# EAGLE design main_SMD_FET (EAGLE 9.6.2)
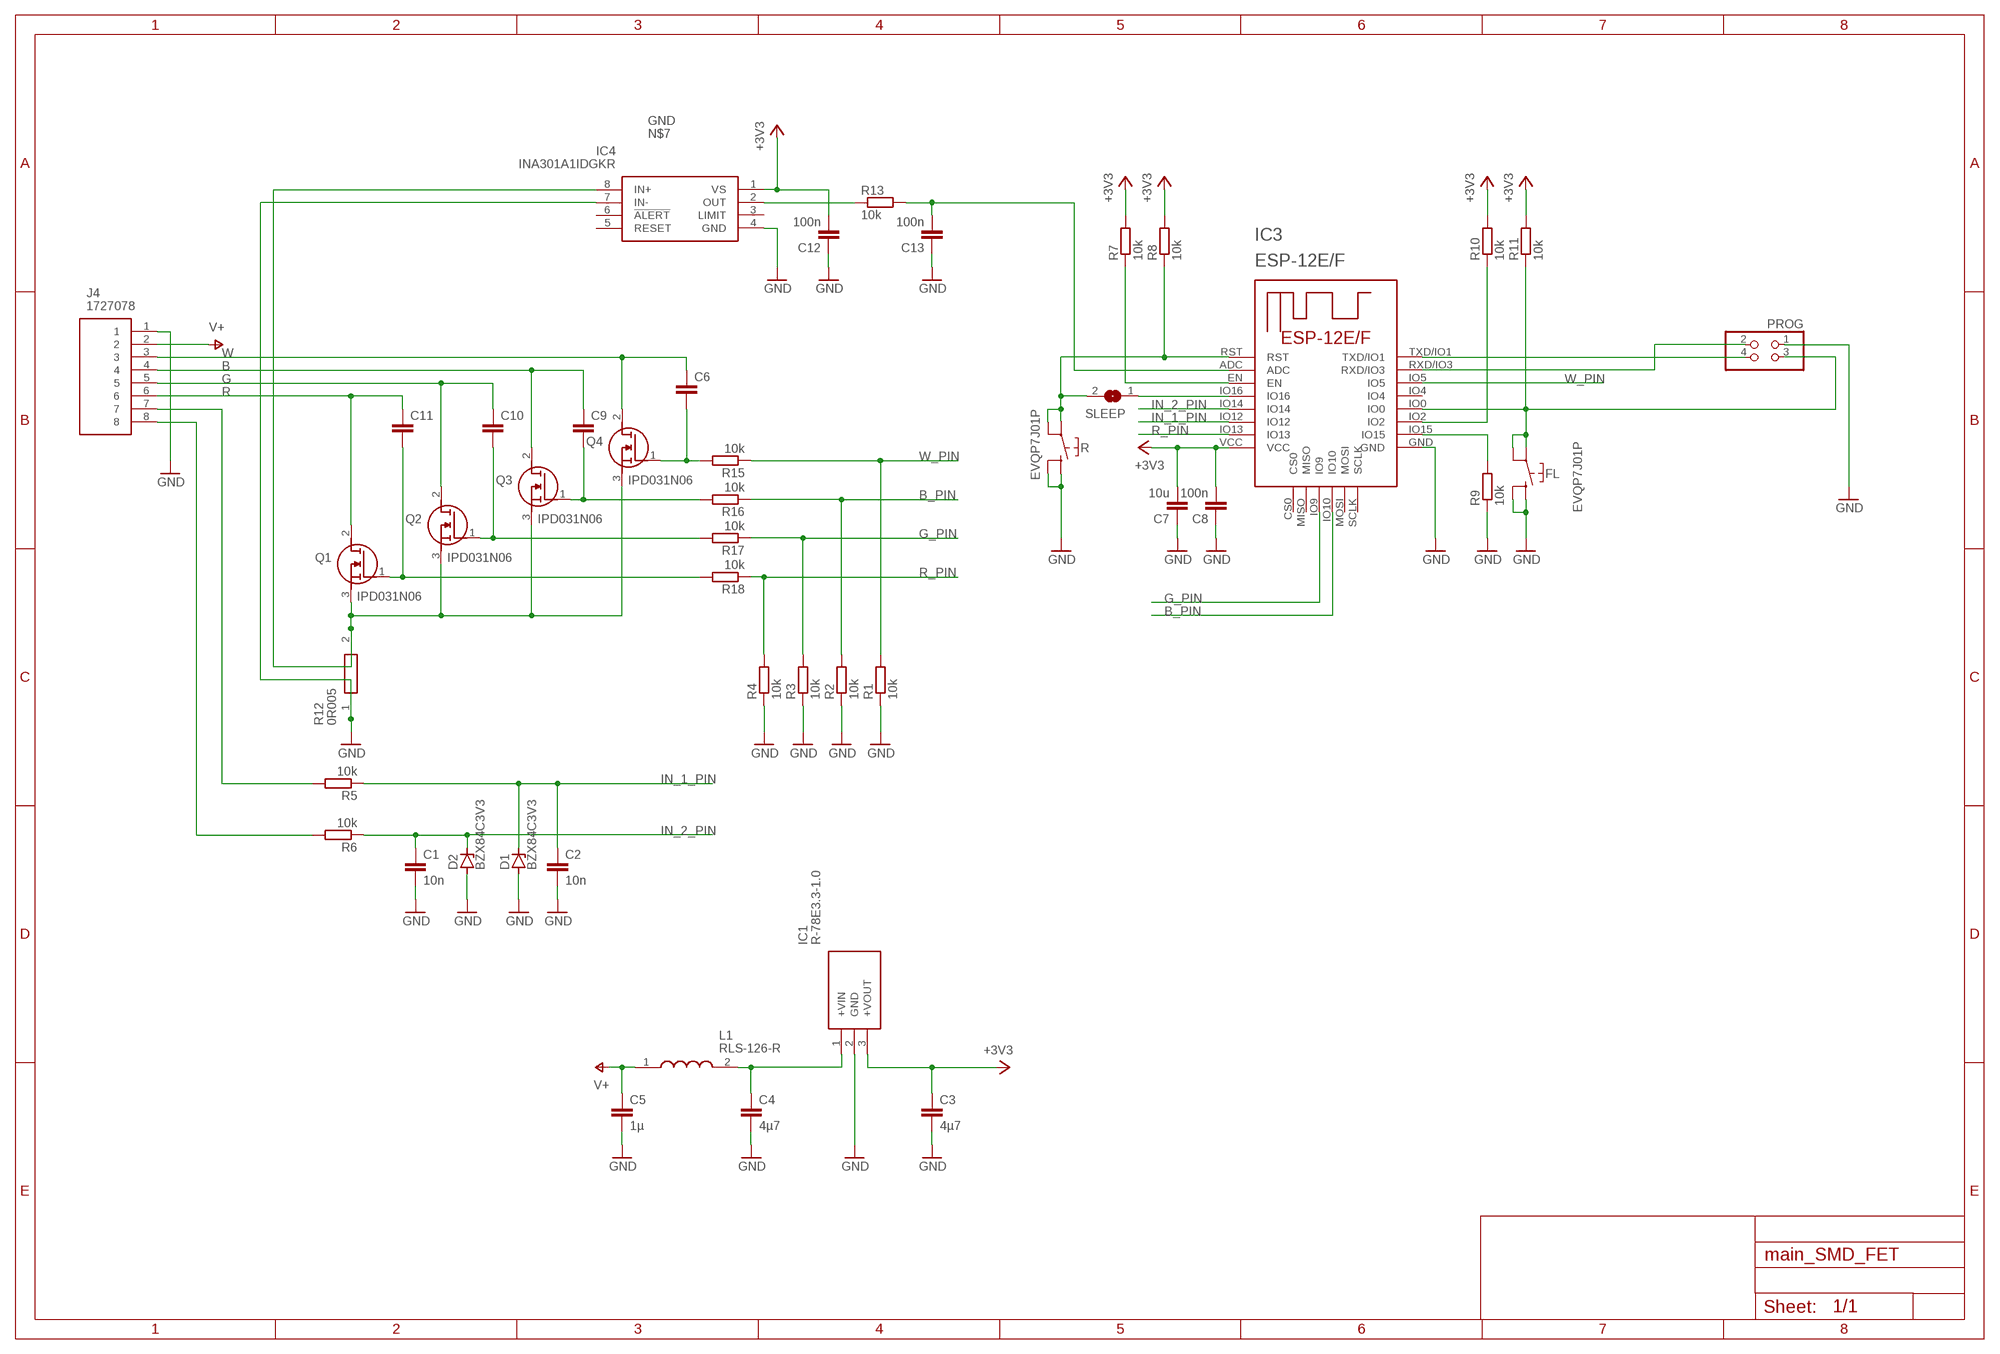
[diagram p0: schematic, sheet 1]

## Parts
C1  10n  C-EUC0603  [C0603]
C2  10n  C-EUC0603  [C0603]
C3  4µ7  C-EUC0603  [C0603]
C4  4µ7  C-EUC1206  [C1206]
C5  1µ  C-EUC1206  [C1206]
C6  C-EUC0402  [C0402]
C7  10u  C-EUC0603  [C0603]
C8  100n  C-EUC0603  [C0603]
C9  C-EUC0402  [C0402]
C10  C-EUC0402  [C0402]
C11  C-EUC0402  [C0402]
C12  100n  C-EUC0603  [C0603]
C13  100n  C-EUC0603  [C0603]
D1  BZX84C3V3  BZX84CSMD  [TO236]
D2  BZX84C3V3  BZX84CSMD  [TO236]
FL  EVQP7J01P  [EVQP7J01P]
IC1  R-78E3.3-1.0  [R78E3310]
IC3  ESP-12E/F  [ESP-12E]
IC4  INA301A1IDGKR  [SOP65P490X110-8N]
J4  1727078  [SHDR8W90P0X381_1X8_3047X730X86]
L1  RLS-126-R  [RLS126R]
PROG  PINHD-2X2  [2X02]
Q1  IPD031N06  IPD031N06L3GATMA1  [IPD031N06L3GATMA1]
Q2  IPD031N06  IPD031N06L3GATMA1  [IPD031N06L3GATMA1]
Q3  IPD031N06  IPD031N06L3GATMA1  [IPD031N06L3GATMA1]
Q4  IPD031N06  IPD031N06L3GATMA1  [IPD031N06L3GATMA1]
R  EVQP7J01P  [EVQP7J01P]
R1  10k  R-EU_R0402  [R0402]
R2  10k  R-EU_R0402  [R0402]
R3  10k  R-EU_R0402  [R0402]
R4  10k  R-EU_R0402  [R0402]
R5  10k  R-EU_R0603  [R0603]
R6  10k  R-EU_R0603  [R0603]
R7  10k  R-EU_R0402  [R0402]
R8  10k  R-EU_R0402  [R0402]
R9  10k  R-EU_R0402  [R0402]
R10  10k  R-EU_R0402  [R0402]
R11  10k  R-EU_R0402  [R0402]
R12  0R005  PCS1206DR0100ET  [RESC3216X68N]
R13  10k  R-EU_R0402  [R0402]
R15  10k  R-EU_R0402  [R0402]
R16  10k  R-EU_R0402  [R0402]
R17  10k  R-EU_R0402  [R0402]
R18  10k  R-EU_R0402  [R0402]
SLEEP  SJ  [SJ]

## Nets
+3V3: C3.1 C7.2 C8.2 C12.2 IC1.3(+VOUT) IC3.VCC IC4.1(VS) R7.2 R8.2 R10.2 R11.2
B: C9.1 J4.4 Q3.2(D)
B_PIN: IC3.IO10 R2.2 R16.1
G: C10.1 J4.5 Q2.2(D)
G_PIN: IC3.IO9 R3.2 R17.1
GND: C1.2 C2.2 C3.2 C4.2 C5.2 C7.1 C8.1 C12.1 C13.1 D1.A D2.A FL.A2(COM_1) FL.B2(COM_2) IC1.2(GND) IC3.GND IC4.4(GND) IC4.7(IN-) J4.1 PROG.1 R1.1 R2.1 R3.1 R4.1 R9.1 R12.1 R.A2(COM_1) R.B2(COM_2)
IN_1_PIN: C2.1 D1.C IC3.IO12 R5.1
IN_2_PIN: C1.1 D2.C IC3.IO14 R6.1
N$: C13.2 IC3.ADC R13.2
N$2: C11.2 Q1.1(G) R18.2
N$3: IC3.RST R8.1 R.A1(NO_1) R.B1(NO_2) SLEEP.2
N$4: J4.7 R5.2
N$5: J4.8 R6.2
N$6: IC3.RXD/IO3 PROG.2
N$7: IC4.8(IN+) Q1.3(S) Q2.3(S) Q3.3(S) Q4.3(S) R12.2
N$8: IC4.2(OUT) R13.1
N$9: C4.1 IC1.1(+VIN) L1.2
N$10: IC3.EN R7.1
N$11: IC3.IO2 R10.1
N$12: C10.2 Q2.1(G) R17.2
N$13: FL.A1(NO_1) FL.B1(NO_2) IC3.IO0 PROG.3 R11.1
N$14: C9.2 Q3.1(G) R16.2
N$15: C6.2 Q4.1(G) R15.2
N$17: IC3.TXD/IO1 PROG.4
N$21: IC3.IO16 SLEEP.1
N$25: IC3.IO15 R9.2
R: C11.1 J4.6 Q1.2(D)
R_PIN: IC3.IO13 R4.2 R18.1
V+: C5.1 J4.2 L1.1
W: C6.1 J4.3 Q4.2(D)
W_PIN: IC3.IO5 R1.2 R15.1
Unconnected: IC3.CS0 IC3.IO4 IC3.MISO IC3.MOSI IC3.SCLK IC4.3(LIMIT) IC4.5(RESET) IC4.6(!ALERT)

## Library data of the parts
C1-C13 = rcl:C-EU: CAPACITOR, European symbol; SPICEPREFIX: C
D1 D2 = diode:BZX84CSMD: Z DIODE
FL R = SamacSys_Parts:EVQP7J01P: PANASONIC - EVQP7J01P - TACTILE SW, SPST-NO, 0.05A, 12V, SMD Source: Datasheet <https://www.arrow.com/en/products/evq-p7j01p/panasonic>; ARROW_PART_NUMBER: EVQP7J01P; ARROW_PRICE-STOCK: https://www.arrow.com/en/products/evq-p7j01p/panasonic; DESCRIPTION: PANASONIC - EVQP7J01P - TACTILE SW, SPST-NO, 0.05A, 12V, SMD; HEIGHT: 1.35mm; MANUFACTURER_NAME: Panasonic; MANUFACTURER_PART_NUMBER: EVQP7J01P
IC1 = SamacSys_Parts:R-78E3.3-1.0: Recom DC-DC Switching Regulator, 7 28V dc Input, 3.3V Output, 1A Source: Datasheet <https://componentsearchengine.com/Datasheets/1/R-78E3.3-1.0.pdf>; ARROW_PART_NUMBER: R-78E3.3-1.0; ARROW_PRICE-STOCK: https://www.arrow.com/en/products/r-78e3.3-1.0/recom-power; DESCRIPTION: Recom DC-DC Switching Regulator, 7 28V dc Input, 3.3V Output, 1A; HEIGHT: 10.9mm; MANUFACTURER_NAME: RECOM Power; MANUFACTURER_PART_NUMBER: R-78E3.3-1.0; MOUSER_PART_NUMBER: 919-R-78E3.3-1.0; MOUSER_PRICE-STOCK: https://www.mouser.co.uk/ProductDetail/RECOM-Power/R-78E33-10/?qs=D0iH%252BVFiYPOgLjjtWWnV0Q%3D%3D
IC3 = esp-12e-f:ESP-12E/F
IC4 = SamacSys_Parts:INA301A1IDGKR: 36V, Low-/High-side, Voltage Output CSA with Comparator Source: Datasheet <http://www.ti.com/lit/gpn/INA301>; ARROW_PART_NUMBER: INA301A1IDGKR; ARROW_PRICE-STOCK: https://www.arrow.com/en/products/ina301a1idgkr/texas-instruments; DESCRIPTION: 36V, Low-/High-side, Voltage Output CSA with Comparator; HEIGHT: 1.1mm; MANUFACTURER_NAME: Texas Instruments; MANUFACTURER_PART_NUMBER: INA301A1IDGKR; MOUSER_PART_NUMBER: 595-INA301A1IDGKR; MOUSER_PRICE-STOCK: https://www.mouser.co.uk/ProductDetail/Texas-Instruments/INA301A1IDGKR/?qs=yajEpaT76uR6go0HjUkNgA%3D%3D
J4 = SamacSys_Parts_PHOENIX:1727078: 3.81mm pitch,vertical mount,PCB,screw terminal,8way Source: Datasheet <https://www.phoenixcontact.com/online/portal/gb?uri=pxc-oc-itemdetail:pid=1727078&library=gben&tab=1>; ALLIED_NUMBER: 70054363; ALLIED_PRICE-STOCK: https://www.alliedelec.com/phoenix-contact-1727078/70054363/; DESCRIPTION: 3.81mm pitch,vertical mount,PCB,screw terminal,8way; HEIGHT: 8.65mm; MANUFACTURER_NAME: Phoenix Contact; MANUFACTURER_PART_NUMBER: 1727078; MOUSER_PART_NUMBER: 651-1727078; MOUSER_PRICE-STOCK: https://www.mouser.com/Search/Refine.aspx?Keyword=651-1727078; RS_PART_NUMBER: 2204399; RS_PRICE-STOCK: https://uk.rs-online.com/web/p/products/2204399
L1 = SamacSys_Parts:RLS-126-R: Fixed Inductors Line Inductors for RECOM Power Supply Source: Datasheet <https://componentsearchengine.com/Datasheets/1/RLS-126-R.pdf>; ARROW_PART_NUMBER: RLS-126-R; ARROW_PRICE-STOCK: https://www.arrow.com/en/products/rls-126-r/recom-power; DESCRIPTION: Fixed Inductors Line Inductors for RECOM Power Supply; HEIGHT: 3.1mm; MANUFACTURER_NAME: RECOM Power; MANUFACTURER_PART_NUMBER: RLS-126-R; MOUSER_PART_NUMBER: 919-RLS-126-R; MOUSER_PRICE-STOCK: https://www.mouser.co.uk/ProductDetail/RECOM-Power/RLS-126-R/?qs=gZXFycFWdAPAKiXpeP%2FMQg%3D%3D
PROG = Tyco_By_element14_Batch_1:PINHD-2X2: PIN HEADER
Q1-Q4 = SamacSys_Parts:IPD031N06L3GATMA1: MOSFET N-Ch 60V 100A DPAK-2 OptiMOS 3 Source: Datasheet <https://datasheet.datasheetarchive.com/originals/dk/DKDS-30/599831.pdf>; ARROW_PART_NUMBER: IPD031N06L3GATMA1; ARROW_PRICE-STOCK: https://www.arrow.com/en/products/ipd031n06l3gatma1/infineon-technologies-ag; DESCRIPTION: MOSFET N-Ch 60V 100A DPAK-2 OptiMOS 3; HEIGHT: 2.563mm; MANUFACTURER_NAME: Infineon; MANUFACTURER_PART_NUMBER: IPD031N06L3GATMA1; MOUSER_PART_NUMBER: 726-IPD031N06L3GATMA; MOUSER_PRICE-STOCK: https://www.mouser.co.uk/ProductDetail/Infineon-Technologies/IPD031N06L3GATMA1/?qs=OwbwYO03UsJYrPy01%2FpZig%3D%3D
R1-R11 R13 R15-R18 = rcl:R-EU_: RESISTOR, European symbol; SPICEPREFIX: R
R12 = SamacSys_Parts:PCS1206DR0100ET: Current Sense Resistors - SMD 1W 0.010 OHMS 0.5% Source: Datasheet <https://componentsearchengine.com//PCS1206DR0100ET.pdf>; DESCRIPTION: Current Sense Resistors - SMD 1W 0.010 OHMS 0.5%; HEIGHT: 0.684mm; MANUFACTURER_NAME: Ohmite; MANUFACTURER_PART_NUMBER: PCS1206DR0100ET; MOUSER_PART_NUMBER: 588-PCS1206DR0100ET; MOUSER_PRICE-STOCK: https://www.mouser.co.uk/ProductDetail/Ohmite/PCS1206DR0100ET/?qs=Zz7%252BYVVL6bH%2F2nwIEMOhrA%3D%3D
SLEEP = jumper:SJ: SMD solder JUMPER

## Board
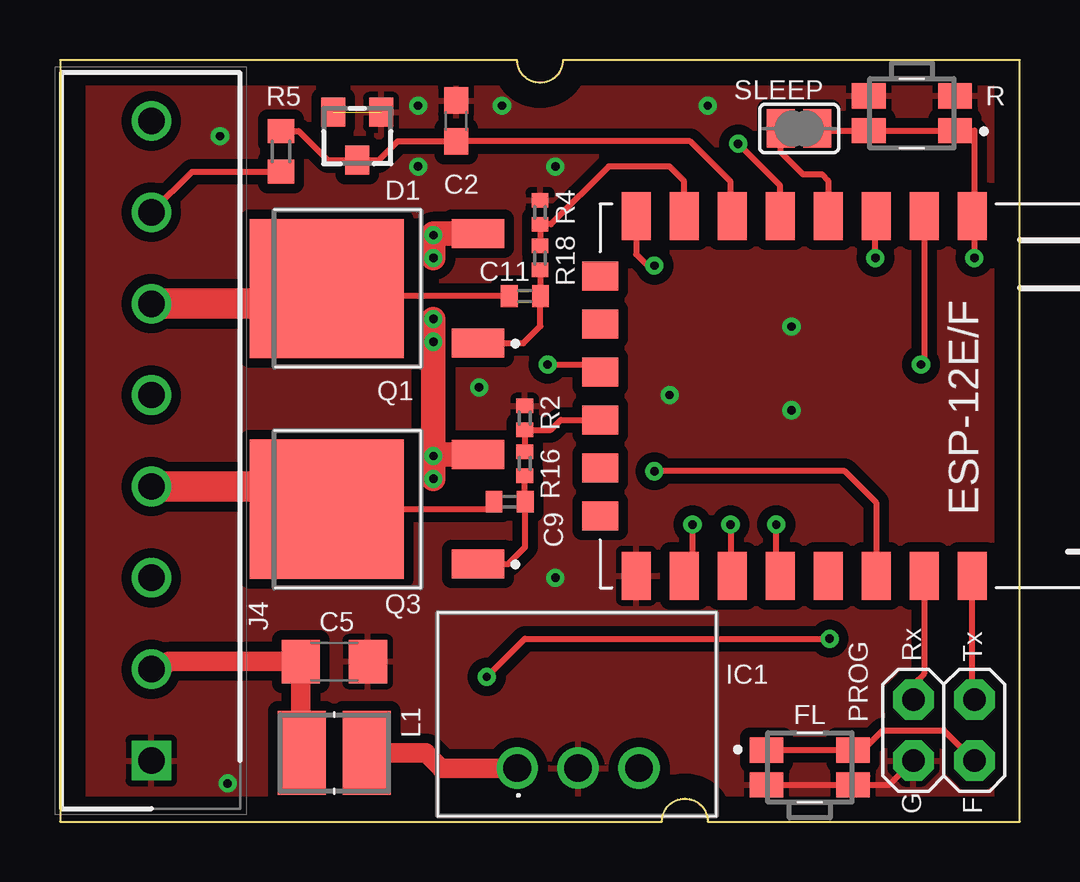
[diagram p1: board, top side]
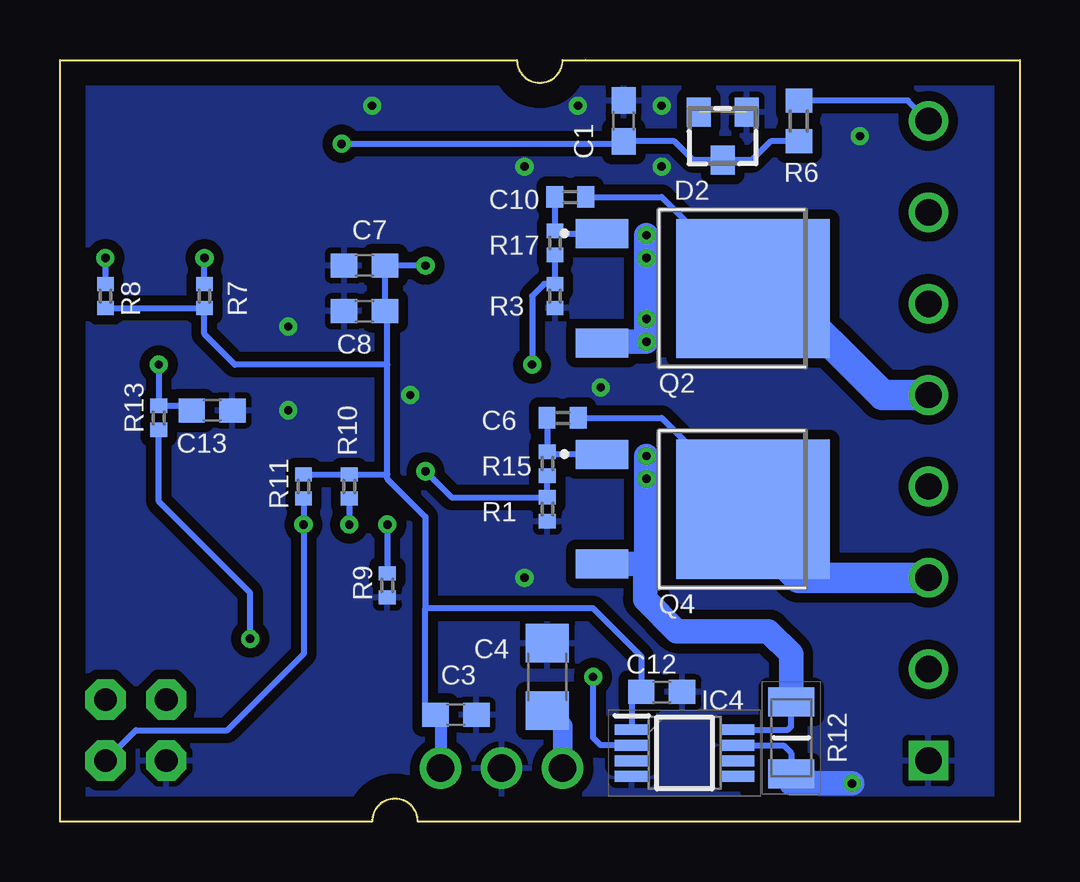
[diagram p2: board, bottom side, seen from below]

Size 39.99 x 31.75 mm. Coordinates in mm from the lower left corner, seen from the top.
Outline: 0,0 25.08,0 arc-180 26.99,0 39.99,0 39.99,31.74 20.95,31.75 arc-180 19.05,31.75 18.09,31.74 0,31.74 0,0
Copper layers (1*16): Top 0.035mm / dielectric 1.5mm / Bottom 0.035mm
Design rules "default": minimum track width 6mil, minimum drill 0.35mm, track to track 6mil, track to pad 6mil, pad to pad 6mil, via to via 6mil, smd to smd 6mil, copper to edge 40mil, drill to drill 6mil, minimum pad ring 10mil, minimum via ring 8mil, stop-mask expansion 4mil, vias tented up to drill 0mil, thermal gap 10mil

### Footprints (pad centres in the part's own frame; a part is rotated, then mirrored left to right if it is on the bottom)
C0603 = smd 1.1 x 1: 1 -0.85,0; 2 0.85,0
C1206 = smd 1.6 x 1.8: 1 -1.4,0; 2 1.4,0
C0402 = smd 0.7 x 0.9: 1 -0.65,0; 2 0.65,0
TO236 = smd 1 x 1.2: A -1,-1; C 0,1; NC 1,-1
EVQP7J01P = smd 1.4 x 1.05: A1 -1.8,0.725; A2 -1.8,-0.725; B1 1.8,0.725; B2 1.8,-0.725
R78E3310 = drill 1.15 pad 1.725: 1 0,0; 2 2.54,0; 3 5.08,0
ESP-12E = smd 2 x 1.2: ADC -7.46,5.53; EN -7.46,3.53; GND 7.54,-6.47; IO0 7.54,-0.47; IO2 7.54,-2.47; IO4 7.54,1.53; IO5 7.54,3.53; IO12 -7.46,-2.47; IO13 -7.46,-4.47; IO14 -7.46,-0.47; IO15 7.54,-4.47; IO16 -7.46,1.53; RST -7.46,7.53; RXD/IO3 7.54,5.53; TXD/IO1 7.54,7.53; VCC -7.46,-6.47 | smd 1.2 x 1.5: CS0 -4.96,-7.97; IO9 -0.96,-7.97; IO10 1.04,-7.97; MISO -2.96,-7.97; MOSI 3.04,-7.97; SCLK 5.04,-7.97
SOP65P490X110-8N = smd 1.4 x 0.45: 1 -2.2,0.975; 2 -2.2,0.325; 3 -2.2,-0.325; 4 -2.2,-0.975; 5 2.2,-0.975; 6 2.2,-0.325; 7 2.2,0.325; 8 2.2,0.975
SHDR8W90P0X381_1X8_3047X730X86 = drill 1.1 pad 1.65 square: 1 0,0 | drill 1.1 pad 1.65: 2 3.81,0; 3 7.62,0; 4 11.43,0; 5 15.24,0; 6 19.05,0; 7 22.86,0; 8 26.67,0
RLS126R = smd 2 x 3.5: 1 -1.35,0; 2 1.35,0
2X02 = drill 0.95 pad 1.676 octagon: 1 -1.27,-1.27; 2 -1.27,1.27; 3 1.27,-1.27; 4 1.27,1.27
IPD031N06L3GATMA1 = smd 1.2 x 2.2: 1 -2.28,-6.3; 3 2.28,-6.3 | smd 5.8 x 6.4: 2 0,0
R0402 = smd 0.6 x 0.7: 1 -0.5,0; 2 0.5,0
R0603 = smd 1 x 1.1: 1 -0.85,0; 2 0.85,0
RESC3216X68N = smd 1.2 x 1.9: 1 -1.5,0; 2 1.5,0
SJ = smd 1.168 x 1.6: 1 -0.762,0; 2 0.762,0

### Placement (x,y rotation side)
C1  16.51,29.21 90 bottom
C2  16.51,29.21 90 top
C3  23.5,4.45 0 bottom
C4  19.68,6.03 90 bottom
C5  11.43,6.67 0 top
C6  19.05,16.83 180 bottom
C7  27.3,23.18 0 bottom
C8  27.3,21.27 0 bottom
C9  18.73,13.34 0 top
C10  18.73,26.04 180 bottom
C11  19.37,21.91 0 top
C12  14.92,5.4 180 bottom
C13  33.66,17.14 180 bottom
D1  12.38,28.57 180 top
D2  12.38,28.57 180 bottom
FL  31.24,2.25 0 top
IC1  19.05,2.22 0 top
IC3  30.48,17.78 270 top
IC4  13.97,2.86 0 bottom
J4  3.81,2.54 90 top
L1  11.43,2.86 0 top
PROG  36.83,3.81 0 top
Q1  11.11,22.23 90 top
Q2  11.11,22.23 270 bottom
Q3  11.11,13.02 90 top
Q4  11.11,13.02 270 bottom
R  35.5,29.53 180 top
R1  19.68,13.02 90 bottom
R2  19.37,16.83 270 top
R3  19.37,21.91 90 bottom
R4  20,25.4 270 top
R5  9.21,27.94 270 top
R6  9.21,29.21 90 bottom
R7  33.97,21.91 270 bottom
R8  38.1,21.91 270 bottom
R9  26.35,9.84 90 bottom
R10  27.94,13.97 90 bottom
R11  29.84,13.97 90 bottom
R12  9.53,3.49 90 bottom
R13  35.88,16.83 90 bottom
R15  19.68,14.92 90 bottom
R16  19.37,14.92 270 top
R17  19.37,24.13 90 bottom
R18  20,23.5 270 top
SLEEP  30.8,28.89 0 top

### Tracks (layer width: path | path; a pad name or v marks a point on that pad's centre or on a via)
+3V3  (via drill 0.35)
  Top 0.254: IC3.VCC 24.01,23.65 24.48,23.18 v24.77,23.18
  Bottom 0.254: 24.13,4.23 C3.1 24.45,4.45 24.77,4.76 24.77,8.89 | R11.2 R10.2 26.35,14.47 | 26.35,14.47 26.35,14.29 24.77,12.7 24.77,8.89 | 26.35,14.47 26.35,19.05 | 26.35,19.05 26.35,21.17 C8.2 C7.2 v24.77,23.18 | 26.35,19.05 32.7,19.05 33.97,20.32 R7.2 R8.2 | 24.77,8.89 17.78,8.89 15.77,6.88 C12.2 16.17,5 IC4.1
  Bottom 0.508: 24.13,4.23 IC1.3
B
  Top 0.254: C9.1 17.77,13.02 Q3.2
  Top 1.27: J4.4 10.16,13.97 Q3.2
B_PIN
  Top 0.254: R16.1 R2.2 20.45,16.33 20.87,16.74 IC3.IO10
G
  Bottom 0.254: C10.1 14.92,26.04 Q2.2
  Bottom 1.27: J4.5 5.71,17.78 10.16,22.23 Q2.2
G_PIN  (via drill 0.35)
  Top 0.254: v20.32,19.05 22.2,19.05 IC3.IO9
  Bottom 0.254: R17.1 R3.2 19.82,22.41 20.32,21.91 v20.32,19.05
GND  (via drill 0.35)  (1 unrouted)
  Top 0.254: FL.A2 FL.B2 | FL.B2 33.28,1.53 33.66,1.91 33.42,1.91 FL.B2 | FL.B2 34.55,1.53 PROG.1
  Bottom 0.254: IC4.7 9.84,3.17 9.53,2.86 R12.1
  Bottom 1.016: R12.1 9.53,1.59 v6.99,1.59
  other vias: 20.64,10.16 20.64,27.3 14.92,27.3 17.46,18.1 25.4,17.78 30.48,20.64 30.48,17.14 6.67,28.57 14.92,29.84 18.41,29.84 26.99,29.84
  pour Top (isolate 0.406): 0,31.75 40.01,31.75 40.01,0 0,0
  pour Bottom (isolate 0.406): 0,31.75 40.01,31.75 40.01,0 11.75,0 11.75,4.29 8.73,4.29 8.73,0 0,0
IN_1_PIN
  Top 0.254: R5.1 9.95,28.79 11.16,27.57 D1.C 13.29,27.57 14.07,28.36 C2.1 26.25,28.36 27.94,26.67 27.94,25.31 IC3.IO12 28.01,25.33
IN_2_PIN  (via drill 0.35)
  Top 0.254: IC3.IO14 30.01,26.5 v28.26,28.26
  Bottom 0.254: 16.36,28.21 C1.1 | R6.1 10.38,28.36 11.16,27.57 D2.C 13.61,27.57 14.39,28.36 C1.1 | v28.26,28.26 16.61,28.26 C1.1
N$  (via drill 0.35)
  Top 0.254: IC3.ADC 36.01,19.18 v35.88,19.05
  Bottom 0.254: C13.2 34.69,17.33 R13.2 v35.88,19.05
N$2
  Top 0.254: Q1.1 19.31,19.95 20.02,20.65 C11.2 20.02,22.98 R18.2
N$3  (via drill 0.35)
  Top 0.254: SLEEP.2 31.65,28.8 R.B1 R.A1 38.1,28.8 38.1,25.33 IC3.RST | IC3.RST 38.01,24.86 38.1,24.77 | IC3.RST 38.01,24.54 38.1,24.45 | IC3.RST 38.1,25.15 v38.1,23.5
  Bottom 0.254: v38.1,23.5 R8.1
N$4
  Top 0.254: R5.2 5.5,27.09 J4.7
N$5
  Bottom 0.254: J4.8 4.66,30.06 R6.2
N$6
  Top 0.254: IC3.RXD/IO3 36.01,6.17 35.56,5.71 PROG.2
N$7  (via drill 0.35)
  Top 0.254: 15.62,15.3 v15.56,15.24
  Top 1.016: Q3.3 15.62,15.3 | v15.56,20.95 v15.56,14.29 | Q1.3 15.56,24.5 v15.56,23.5
  Bottom 0.254: 9.39,5.13 R12.2 9.53,3.97 9.66,3.83 IC4.8 11.75,3.81 | Q4.3 17.36,10.79 | 15.62,10.74 15.56,10.79
  Bottom 1.016: 15.56,10.79 v15.56,14.29 v15.56,15.24 | Q2.3 17.36,20 v15.56,20 v15.56,20.95 v15.56,23.5 v15.56,24.45 | Q4.3 15.62,10.74 15.62,9.27 14.29,7.94 10.48,7.94 9.53,6.99 R12.2
N$8  (via drill 0.35)
  Top 0.254: v17.78,6.03 19.37,7.62 v32.07,7.62
  Bottom 0.254: IC4.2 17.47,3.18 17.78,3.49 v17.78,6.03 | v32.07,7.62 32.07,9.53 35.88,13.34 R13.1
N$9
  Top 0.813: L1.2 15.24,2.86 15.88,2.22 IC1.1
  Bottom 0.254: 19.05,4 C4.1
  Bottom 0.813: 19.05,4 IC1.1
N$10  (via drill 0.35)
  Top 0.254: v33.97,23.5 33.97,25.2 IC3.EN
  Bottom 0.254: R7.1 v33.97,23.5
N$11  (via drill 0.35)
  Top 0.254: IC3.IO2 27.94,10.24 v27.94,12.38
  Bottom 0.254: R10.1 v27.94,12.38
N$12
  Bottom 0.254: Q2.1 19.24,24.5 R17.2 19.37,26.02 C10.2
N$13  (via drill 0.35)
  Top 0.254: IC3.IO0 29.84,10.24 v29.84,12.38 | FL.A1 FL.B1 33.46,2.98 34.29,3.81 36.83,3.81 PROG.3
  Bottom 0.254: R11.1 v29.84,12.38 29.84,6.99 33.02,3.81 36.83,3.81 PROG.3
N$14
  Top 0.254: 17.41,11.05 Q3.1 18.68,10.74 19.38,11.45 C9.2 19.37,13.35 R16.2
N$15
  Bottom 0.254: 19.56,15.3 19.7,15.3 C6.2 | Q4.1 19.56,15.3 | 19.56,15.3 R15.2
N$17
  Top 0.254: PROG.4 38.01,5.17 IC3.TXD/IO1
N$21
  Top 0.254: SLEEP.1 30.04,27.91 30.96,26.99 31.75,26.99 32.01,26.73 IC3.IO16
N$25  (via drill 0.35)
  Top 0.254: IC3.IO15 26.35,10.58 v26.35,12.38
  Bottom 0.254: v26.35,12.38 R9.2
R
  Top 0.254: Q1.2 11.43,21.91 C11.1
  Top 1.27: J4.6 10.48,21.59 Q1.2
R_PIN
  Top 0.254: R18.1 R4.2 20.45,24.9 22.86,27.3 25.4,27.3 26.01,26.7 IC3.IO13
V+
  Top 0.254: 4,6.16 J4.2 | 10.03,2.67 10.08,2.62 L1.1
  Top 0.813: 4,6.16 4.54,6.67 C5.1 10.03,2.67
W
  Bottom 0.254: C6.1 14.92,16.83 Q4.2
  Bottom 1.27: J4.3 9.21,10.16 11.11,12.06 Q4.2
W_PIN  (via drill 0.35)
  Top 0.254: IC3.IO5 34.01,13.3 32.7,14.61 v24.77,14.61
  Bottom 0.254: v24.77,14.61 23.68,13.52 R1.2 R15.1

### Text on the board
tNames: Rx | Tx | G | F